# Altium project IF_transformer.PrjPcb
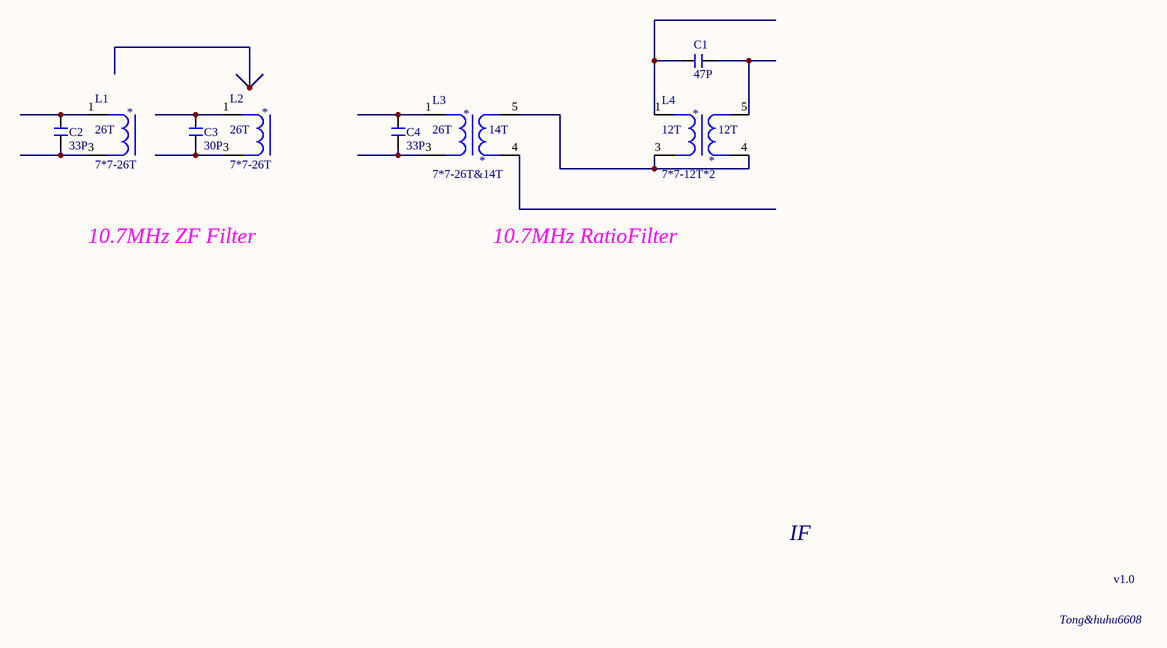
[diagram p0: IF_transformer.SchDoc]
1 sheet, 8 parts. Net scope: global (net labels, ports and power ports of the same name join across sheets).
Board file: IF_transformer.PcbDoc

## Sheet IF_transformer.SchDoc
size A4

### Parts
C1  47P  [C 1206]
C2  33P  [C 1206]
C3  30P  [C 1206]
C4  33P  [C 1206]
L1  7*7-26T  [adj_L_77]
L2  7*7-26T  [adj_L_77]
L3  7*7-26T&14T  [adj_L_77]
L4  7*7-12T*2  [adj_L_77]

### Nets
NetC1_1: C1.1 L4.1
NetC1_2: C1.2 L4.5
NetC2_1: C2.1 L1.1
NetC2_2: C2.2 L1.3
NetC3_1: C3.1 L2.1
NetC3_2: C3.2 L2.3
NetC4_1: C4.1 L3.1
NetC4_2: C4.2 L3.3
NetL3_5: L3.5 L4.3 L4.4

Not connected (* = marked no-connect by the designer): L3 4

### Notes on the sheet
- 10.7MHz ZF Filter
- 10.7MHz RatioFilter
- IF
- v1.0
- Tong&huhu6608
- (in symbol 7*7-12T*2) 12T
- (in symbol 7*7-26T) 26T
- (in symbol 7*7-26T&14T) 26T; 14T

### Library data of the parts
C1-C4 = Cap-CER-SMD: 瓷片电容-贴片